# EAGLE design mouse17-18_v5.0.1.1 (EAGLE 8.4.0)
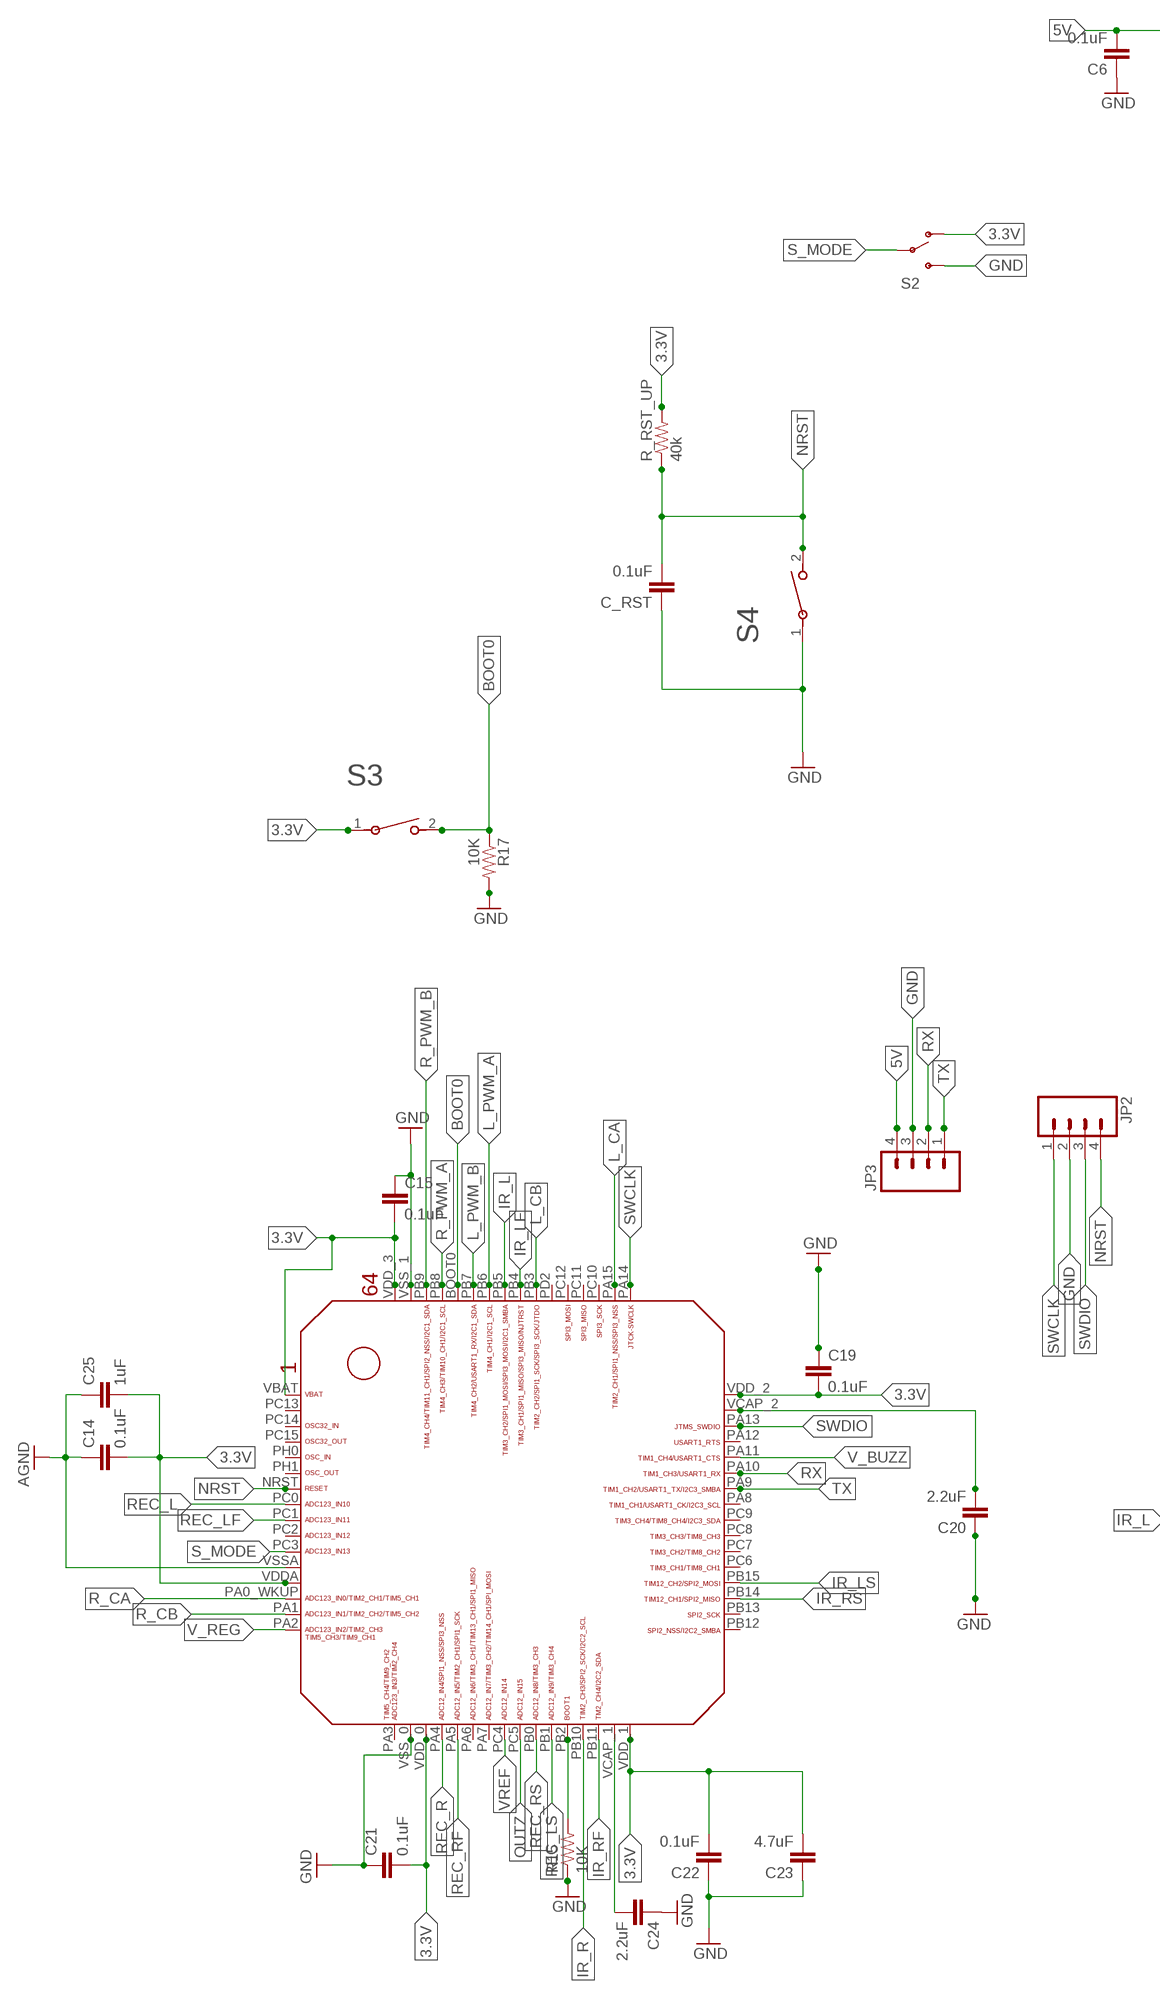
[diagram p0: schematic, sheet 1, part 1 of 2]
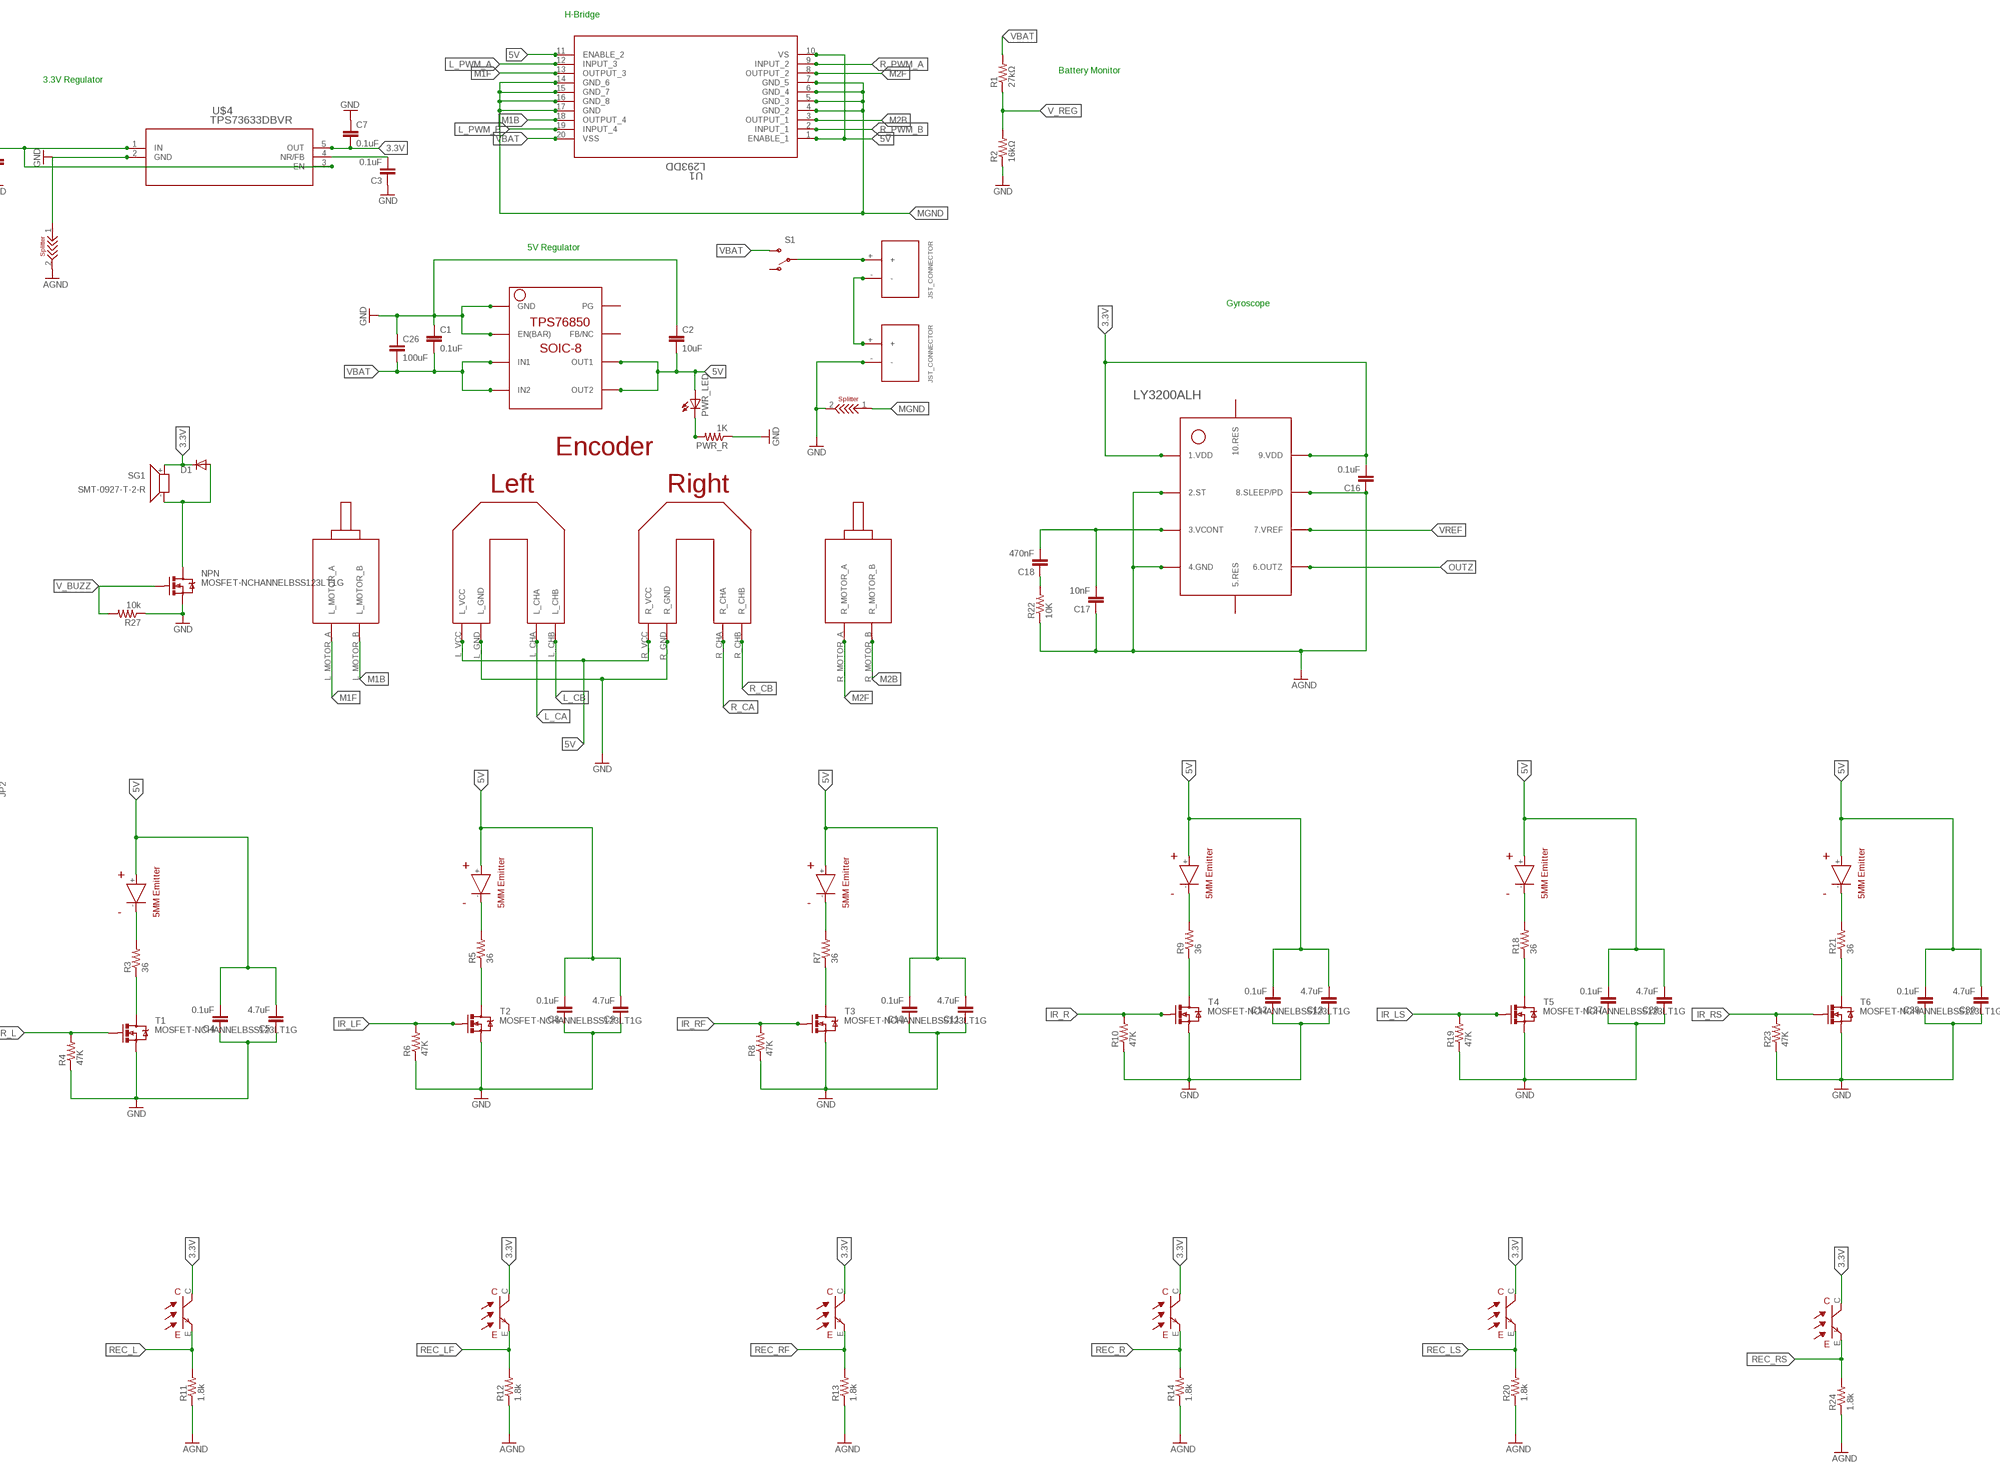
[diagram p1: schematic, sheet 1, part 2 of 2]

## Parts
C1  0.1uF  CAP0805  [0805]
C2  10uF  CAP0805  [0805]
C3  0.1uF  CC0603  [C0603]
C4  0.1uF  0.1UF-25V-5%(0603)  [0603-CAP]
C5  4.7uF  4.7UF-6.3V-10%(0603)0603  [0603-CAP]
C6  0.1uF  CC0603  [C0603]
C7  0.1uF  CC0603  [C0603]
C8  0.1uF  0.1UF-25V-5%(0603)  [0603-CAP]
C9  4.7uF  4.7UF-6.3V-10%(0603)0603  [0603-CAP]
C10  0.1uF  0.1UF-25V-5%(0603)  [0603-CAP]
C11  4.7uF  4.7UF-6.3V-10%(0603)0603  [0603-CAP]
C12  0.1uF  0.1UF-25V-5%(0603)  [0603-CAP]
C13  4.7uF  4.7UF-6.3V-10%(0603)0603  [0603-CAP]
C14  0.1uF  0.1UF-25V-5%(0603)  [0603-CAP]
C15  0.1uF  0.1UF-25V-5%(0603)  [0603-CAP]
C16  0.1uF  CAP0603-CAP  [0603-CAP]
C17  10nF  CAP0603-CAP  [0603-CAP]
C18  470nF  CAP0603-CAP  [0603-CAP]
C19  0.1uF  0.1UF-25V-5%(0603)  [0603-CAP]
C20  2.2uF  0.1UF-25V-5%(0603)  [0603-CAP]
C21  0.1uF  0.1UF-25V-5%(0603)  [0603-CAP]
C22  0.1uF  10UF-6.3V-20%(0603)  [0603-CAP]
C23  4.7uF  4.7UF-6.3V-10%(0603)0603  [0603-CAP]
C24  2.2uF  0.1UF-25V-5%(0603)  [0603-CAP]
C25  1uF  0.1UF-25V-5%(0603)  [0603-CAP]
C26  100uF  CC1210  [C1210]
C27  0.1uF  0.1UF-25V-5%(0603)  [0603-CAP]
C28  4.7uF  4.7UF-6.3V-10%(0603)0603  [0603-CAP]
C29  0.1uF  0.1UF-25V-5%(0603)  [0603-CAP]
C30  4.7uF  4.7UF-6.3V-10%(0603)0603  [0603-CAP]
C_RST  0.1uF  0.1UF-25V-5%(0603)  [0603-CAP]
D1  DIODESMA  [SMA-DIODE]
JP2  M04PTH  [1X04]
JP3  M04PTH  [1X04]
NPN  MOSFET-NCHANNELBSS123LT1G  [SOT23-3]
PWR_LED  LED_ESML0603  [LED_SML0603]
PWR_R  1K  RESISTOR0805-RES  [0805]
R1  27kΩ  RESISTOR0805-RES  [0805]
R2  16kΩ  RESISTOR0805-RES  [0805]
R3  36  RESISTOR0805-RES  [0805]
R4  47K  47KOHM1/10W1%(0603)  [0603-RES]
R5  36  RESISTOR0805-RES  [0805]
R6  47K  47KOHM1/10W1%(0603)  [0603-RES]
R7  36  RESISTOR0805-RES  [0805]
R8  47K  47KOHM1/10W1%(0603)  [0603-RES]
R9  36  RESISTOR0805-RES  [0805]
R10  47K  47KOHM1/10W1%(0603)  [0603-RES]
R11  1.8k  1.8KOHM1/10W1%(0603)  [0603-RES]
R12  1.8k  1.8KOHM1/10W1%(0603)  [0603-RES]
R13  1.8k  1.8KOHM1/10W1%(0603)  [0603-RES]
R14  1.8k  1.8KOHM1/10W1%(0603)  [0603-RES]
R15  10K  10KOHM-1/10W-1%(0603)0603  [0603-RES]
R17  10K  10KOHM-1/10W-1%(0603)0603  [0603-RES]
R18  36  RESISTOR0805-RES  [0805]
R19  47K  47KOHM1/10W1%(0603)  [0603-RES]
R20  1.8k  1.8KOHM1/10W1%(0603)  [0603-RES]
R21  36  RESISTOR0805-RES  [0805]
R22  10K  RESISTOR0603-RES  [0603-RES]
R23  47K  47KOHM1/10W1%(0603)  [0603-RES]
R24  1.8k  1.8KOHM1/10W1%(0603)  [0603-RES]
R27  10k  20OHM1/10W1%(0603)SMD  [0603-RES]
R_RST_UP  40k  10KOHM-1/10W-1%(0603)0603  [0603-RES]
S1  SWITCH-SPSTPTH  [SWITCH-SPDT]
S2  SWITCH-SPST-SMD-A  [SWITCH-SPST-SMD-A]
S3  1825965-1  [SWDIP2_256X198P100]
S4  1825965-1  [SWDIP2_256X198P100]
SG1  SMT-0927-T-2-R  [SMT-0927-T-2-R]
T1  MOSFET-NCHANNELBSS123LT1G  [SOT23-3]
T2  MOSFET-NCHANNELBSS123LT1G  [SOT23-3]
T3  MOSFET-NCHANNELBSS123LT1G  [SOT23-3]
T4  MOSFET-NCHANNELBSS123LT1G  [SOT23-3]
T5  MOSFET-NCHANNELBSS123LT1G  [SOT23-3]
T6  MOSFET-NCHANNELBSS123LT1G  [SOT23-3]
U1  L293DD  [SO-20]
U$1  TPS76850(SOIC-8)  [TPS76850(SOIC-8)]
U$2  JST_CONNECTOR_FEMALE  [JST_CONNECTOR_FEMALE]
U$3  JST_CONNECTOR_FEMALE  [JST_CONNECTOR_FEMALE]
U$4  TPS73633DBVR  [DBV5]
U$5  FUTURA_V1.0_MOTOR_MOUNT  [FUTURA_V1.0_MOTOT_MOUNT]
U$6  EMITTER  [EMITTER]
U$7  EMITTER  [EMITTER]
U$8  EMITTER  [EMITTER]
U$9  EMITTER  [EMITTER]
U$11  RECEIVER  [RECEIVER]
U$13  SPLITTER  [SPLITTER]
U$15  RECEIVER  [RECEIVER]
U$17  STM32F405/415_LQFP64  [STM32F405/415_LQFP64]
U$18  RECEIVER  [RECEIVER]
U$19  RECEIVER  [RECEIVER]
U$22  SPLITTER  [SPLITTER]
U$23  LY3200ALH  [LY3200ALH]
U$25  EMITTER  [EMITTER]
U$27  RECEIVER  [RECEIVER]
U$28  EMITTER  [EMITTER]
U$30  RECEIVER  [RECEIVER]

## Nets
3.3V: C7.2 C14.2 C15.2 C16.2 C19.2 C21.2 C22.2 C23.2 C25.2 D1.C R_RST_UP.2 S2.1(O) S3.1 SG1.+ U$4.5(OUT) U$11.C U$15.C U$17.VBAT U$17.VDD_0 U$17.VDD_1 U$17.VDD_2 U$17.VDD_3 U$17.VDDA U$18.C U$19.C U$23.1.VDD@1(1.VDD) U$23.9.VDD@2(9.VDD) U$27.C U$30.C
5V: C2.2 C4.2 C5.2 C6.2 C8.2 C9.2 C10.2 C11.2 C12.2 C13.2 C27.2 C28.2 C29.2 C30.2 JP3.4 PWR_LED.A U1.1(ENABLE_1) U1.10(VS) U1.11(ENABLE_2) U$1.OUT1 U$1.OUT2 U$4.1(IN) U$4.3(EN) U$5.L_VCC U$5.R_VCC U$6.+ U$7.+ U$8.+ U$9.+ U$25.+ U$28.+
AGND: C14.1 C16.1 C17.1 C25.1 R11.1 R12.1 R13.1 R14.1 R20.1 R22.1 R24.1 U$13.2 U$17.VSSA U$23.2.ST U$23.4.GND U$23.8.SLEEP/PD
BOOT0: R17.1 S3.2 U$17.BOOT0
GND: C1.1 C2.1 C3.1 C4.1 C5.1 C6.1 C7.1 C8.1 C9.1 C10.1 C11.1 C12.1 C13.1 C15.1 C19.1 C20.1 C21.1 C22.1 C23.1 C24.1 C26.1 C27.1 C28.1 C29.1 C30.1 C_RST.1 JP2.2 JP3.3 NPN.2(S) PWR_R.1 R2.1 R4.1 R6.1 R8.1 R10.1 R15.1 R17.2 R19.1 R23.1 R27.1 S2.3(S) S4.1 T1.2(S) T2.2(S) T3.2(S) T4.2(S) T5.2(S) T6.2(S) U$1.EN(BAR) U$1.GND U$3.- U$4.2(GND) U$5.L_GND U$5.R_GND U$13.1 U$17.VSS_0 U$17.VSS_1 U$22.2
IR_L: R4.2 T1.1(G) U$17.PB5
IR_LF: R6.2 T2.1(G) U$17.PB4
IR_LS: R19.2 T5.1(G) U$17.PB15
IR_R: R10.2 T4.1(G) U$17.PB10
IR_RF: R8.2 T3.1(G) U$17.PB11
IR_RS: R23.2 T6.1(G) U$17.PB14
L_CA: U$5.L_CHA U$17.PA15
L_CB: U$5.L_CHB U$17.PB3
L_PWM_A: U1.12(INPUT_3) U$17.PB6
L_PWM_B: U1.19(INPUT_4) U$17.PB7
LED_L: R3.2 U$6.-
LED_LF: R5.2 U$7.-
LED_LS: R18.2 U$25.-
LED_R: R9.2 U$9.-
LED_RF: R7.2 U$8.-
LED_RS: R21.2 U$28.-
M1B: U1.18(OUTPUT_4) U$5.L_MOTOR_B
M1F: U1.13(OUTPUT_3) U$5.L_MOTOR_A
M2B: U1.3(OUTPUT_1) U$5.R_MOTOR_B
M2F: U1.8(OUTPUT_2) U$5.R_MOTOR_A
MGND: U1.4(GND_2) U1.5(GND_3) U1.6(GND_4) U1.7(GND_5) U1.14(GND_6) U1.15(GND_7) U1.16(GND_8) U1.17(GND) U$22.1
N$1: S1.2(P) U$2.+
N$2: U$2.- U$3.+
N$4: R5.1 T2.3(D)
N$6: D1.A NPN.3(D) SG1.-
N$7: R3.1 T1.3(D)
N$8: R7.1 T3.3(D)
N$10: R9.1 T4.3(D)
N$11: C17.2 C18.2 U$23.3.VCONT
N$12: C3.2 U$4.4(NR/FB)
N$13: C20.2 U$17.VCAP_2
N$14: C24.2 U$17.VCAP_1
N$16: R15.2 U$17.PB2
N$18: C18.1 R22.2
N$20: PWR_LED.C PWR_R.2
N$21: R18.1 T5.3(D)
N$23: R21.1 T6.3(D)
NRST: C_RST.2 JP2.4 R_RST_UP.1 S4.2 U$17.NRST
OUTZ: U$17.PC5 U$23.6.OUTZ
R_CA: U$5.R_CHA U$17.PA0_WKUP(PA0_AKUP)
R_CB: U$5.R_CHB U$17.PA1
R_PWM_A: U1.9(INPUT_2) U$17.PB8
R_PWM_B: U1.2(INPUT_1) U$17.PB9
REC_L: R11.2 U$17.PC0 U$19.E
REC_LF: R12.2 U$17.PC1 U$18.E
REC_LS: R20.2 U$17.PB1 U$27.E
REC_R: R14.2 U$11.E U$17.PA4
REC_RF: R13.2 U$15.E U$17.PA5
REC_RS: R24.2 U$17.PB0 U$30.E
RX: JP3.2 U$17.PA10
S_MODE: S2.2(P) U$17.PC3
SWCLK: JP2.1 U$17.PA14
SWDIO: JP2.3 U$17.PA13
TX: JP3.1 U$17.PA9
V_BUZZ: NPN.1(G) R27.2 U$17.PA11
V_REG: R1.1 R2.2 U$17.PA2
VBAT: C1.2 C26.2 R1.2 S1.3(S) U1.20(VSS) U$1.IN1 U$1.IN2
VREF: U$17.PC4 U$23.7.VREF
Unconnected: S1.1(O) U$1.FB/NC U$1.PG U$17.PA3 U$17.PA6 U$17.PA7 U$17.PA8 U$17.PA12 U$17.PB12 U$17.PB13 U$17.PC2 U$17.PC6 U$17.PC7 U$17.PC8 U$17.PC9 U$17.PC10 U$17.PC11 U$17.PC12 U$17.PC13 U$17.PC14 U$17.PC15 U$17.PD2 U$17.PH0 U$17.PH1 U$23.5.RES@1(5.RES) U$23.10.RES@2(10.RES)

## Notes on the sheet
- H-Bridge
- Battery Monitor
- 3.3V Regulator
- 5V Regulator
- Gyroscope

## Library data of the parts
C1 C2 C16-C18 = SparkFun:CAP: Capacitor Standard 0603 ceramic capacitor, and 0.1" leaded capacitor.
C3 C6 C7 C26 = eagle-ltspice:C: CAPACITOR, European symbol; SPICEMODEL: NONE; SPICEPREFIX: C
C4 C8 C10 C12 C14 C15 C19 C21 C27 C29 C_RST = SparkFun-Capacitors:0.1UF-25V-5%(0603): CAP-08604; PROD_ID: CAP-08604
C5 C9 C11 C13 C23 C28 C30 = SparkFun-Capacitors:4.7UF-6.3V-10%(0603): CAP-08280; PROD_ID: CAP-08280
C20 C24 C25 = SparkFun-Capacitors:0.1UF-25V-5%(0603): CAP-08604; PROD_ID: CAP-08604; VALUE: 0.1uF
C22 = SparkFun-Capacitors:10UF-6.3V-20%(0603): CAP-11015; PROD_ID: CAP-11015; VALUE: 10uF
D1 = SparkFun:DIODE: Diode These are standard reverse protection diodes and small signal diodes. SMA package can handle up to about 1A. SOD-323 can handle about 200mA. What the SOD-323 package when ordering, there are some mfgs out there that are 5-pin packages.
JP2 JP3 = SparkFun:M04: Header 4 Standard 4-pin 0.1" header. Use with straight break away headers (SKU : PRT-00116), right angle break away headers (PRT-00553), swiss pins (PRT-00743), machine pins (PRT-00117), and female headers (PRT-00115). Molex polarized connector foot print use with SKU : PRT-08231 with associated crimp pins and housings. 1MM SMD Version SKU: PRT-10208
NPN T1-T6 = SparkFun-DiscreteSemi:MOSFET-NCHANNEL: Common NMOSFET Parts MFG P/N Store ID Prod ID FDD8780 TRANS-09984 SI7820DN TRANS-11055 FDS6630A IC-08089 2N7002PW TRANS-11151 FQP30N06L COM-10213 TRANS-10060 BSS123LT1G TRANS-08345 BSS138 TRANS-00830 BS170 2N7000; PROD_ID: TRANS-08345
PWR_LED = eagle-ltspice:LED_E: LED Source: http://www.osram.convergy.de Source: www.luxeon.com Source: www.kingbright.com; SPICEMODEL: NONE; SPICEPREFIX: D; SPICETYPE: diode
PWR_R R1 R2 = SparkFun:RESISTOR: Resistor Basic schematic elements and footprints for 0603, 1206, and PTH resistors.
R3 R5 R7 R9 R18 R21 R22 = SparkFun-Passives:RESISTOR: Resistor Basic schematic elements and footprints for 0603, 1206, and PTH resistors.
R4 R6 R8 R10 R19 R23 = SparkFun-Resistors:47KOHM1/10W1%(0603): RES-07871; PROD_ID: RES-07871
R11-R14 R20 R24 = SparkFun-Resistors:1.8KOHM1/10W1%(0603): RES-09119; PROD_ID: RES-09119
R15 R17 = SparkFun-Resistors:10KOHM-1/10W-1%(0603): RES-00824; PROD_ID: RES-00824
R27 = SparkFun-Resistors:20OHM1/10W1%(0603): RES-07862; PROD_ID: RES-07862; VALUE: 20
R_RST_UP = SparkFun-Resistors:10KOHM-1/10W-1%(0603): RES-00824; PROD_ID: RES-00824; VALUE: 10K
S1 S2 = SparkFun:SWITCH-SPST: SPST Switch Simple slide switch. Spark Fun Electronics SKU : COM-00102
S3 S4 = 1825965-1:1825965-1; MANUFACTURER_PART_NUMBER: 18259651; VENDOR: Tyco Electronics
SG1 = SMT-0927-T-2-R:SMT-0927-T-2-R: SMD TRANSDUCER 3VP-P 80MA
U1 = L293DD:L293DD; MANUFACTURER_PART_NUMBER: L293DD; VENDOR: ST Microelectronics
U$1 = TPS76850(SOIC-8):TPS76850(SOIC-8)
U$2 U$3 = JST_CONNECTOR_FEMALE. through hole:JST_CONNECTOR_FEMALE
U$4 = TPS73633DBVR:TPS73633DBVR; MANUFACTURER_PART_NUMBER: TPS73633DBVR; VENDOR: Texas Instruments
U$5 = Futura 1.0 motor mount template:FUTURA_V1.0_MOTOR_MOUNT
U$6-U$9 U$25 U$28 = sfh4550 & teft4300:EMITTER
U$11 U$15 U$18 U$19 U$27 U$30 = sfh4550 _ teft4300:RECEIVER
U$13 U$22 = splitter:SPLITTER
U$17 = STM32F10x F4xx:STM32F405/415_LQFP64
U$23 = LY3200ALH:LY3200ALH

## Net classes
0 default: width 0.127 mm
1 VBAT: width 1.905 mm
2 MOTOR: width 1.143 mm
3 IRLED: width 1.016 mm
4 IRREC: width 0.889 mm

## Board
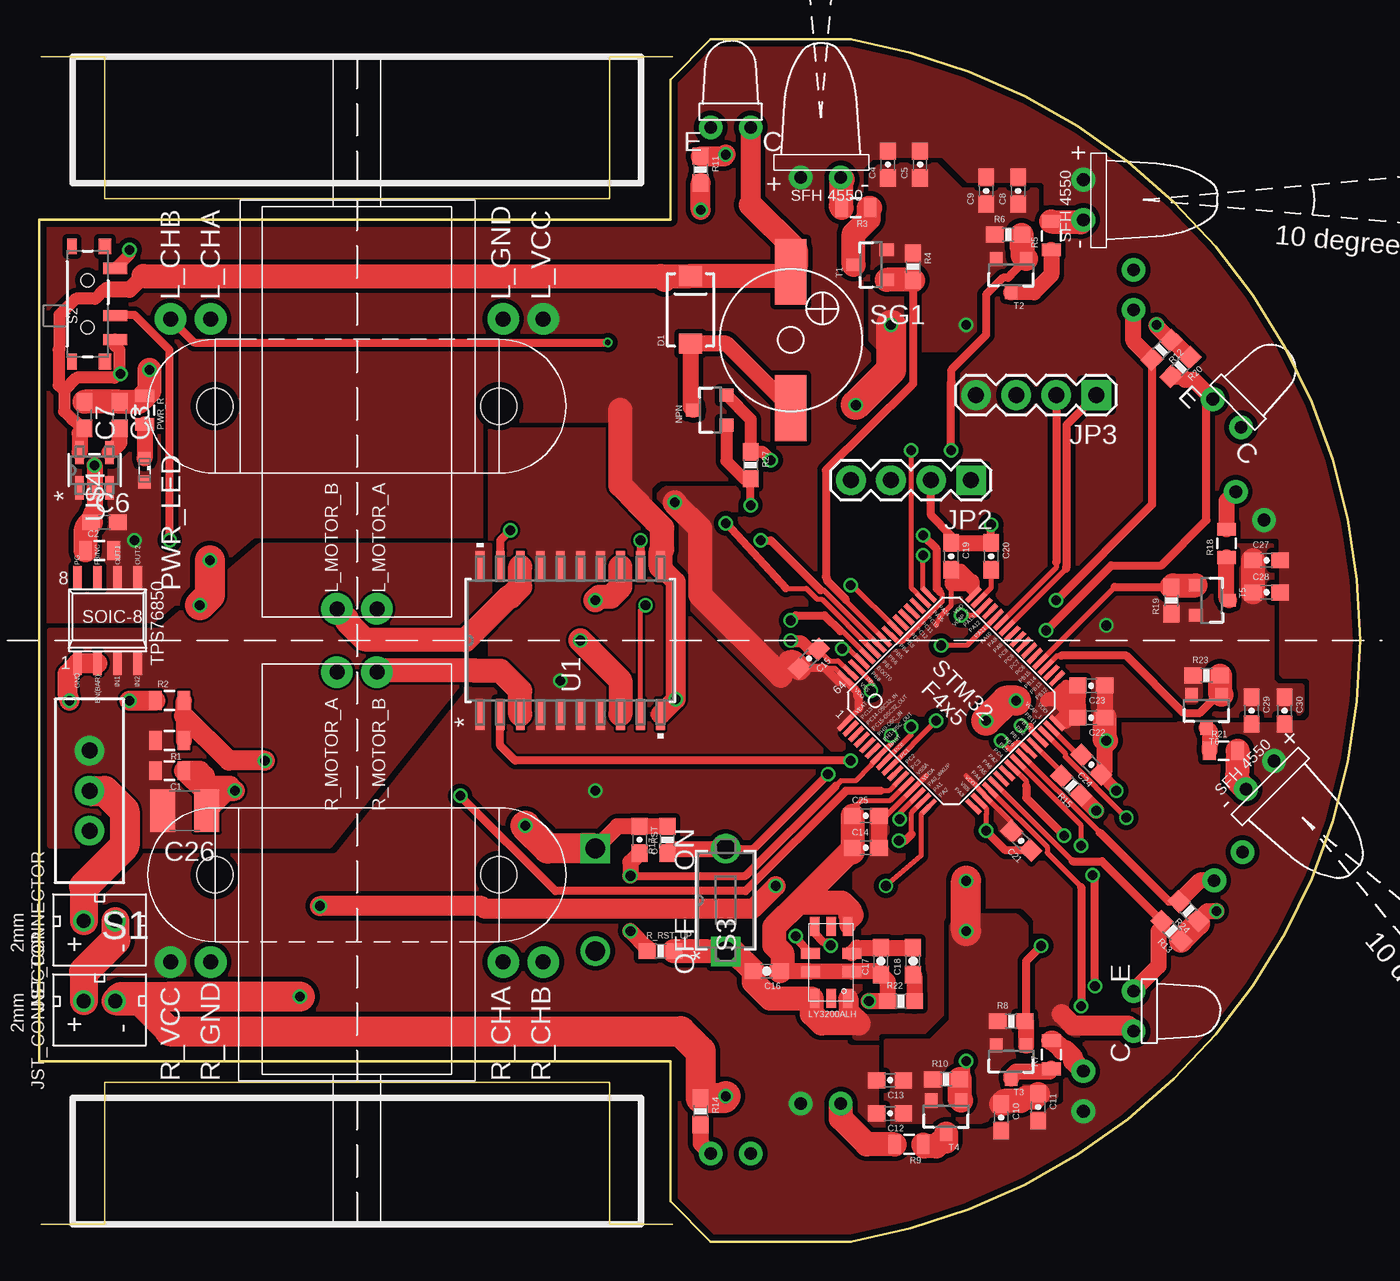
[diagram p2: board, top side]
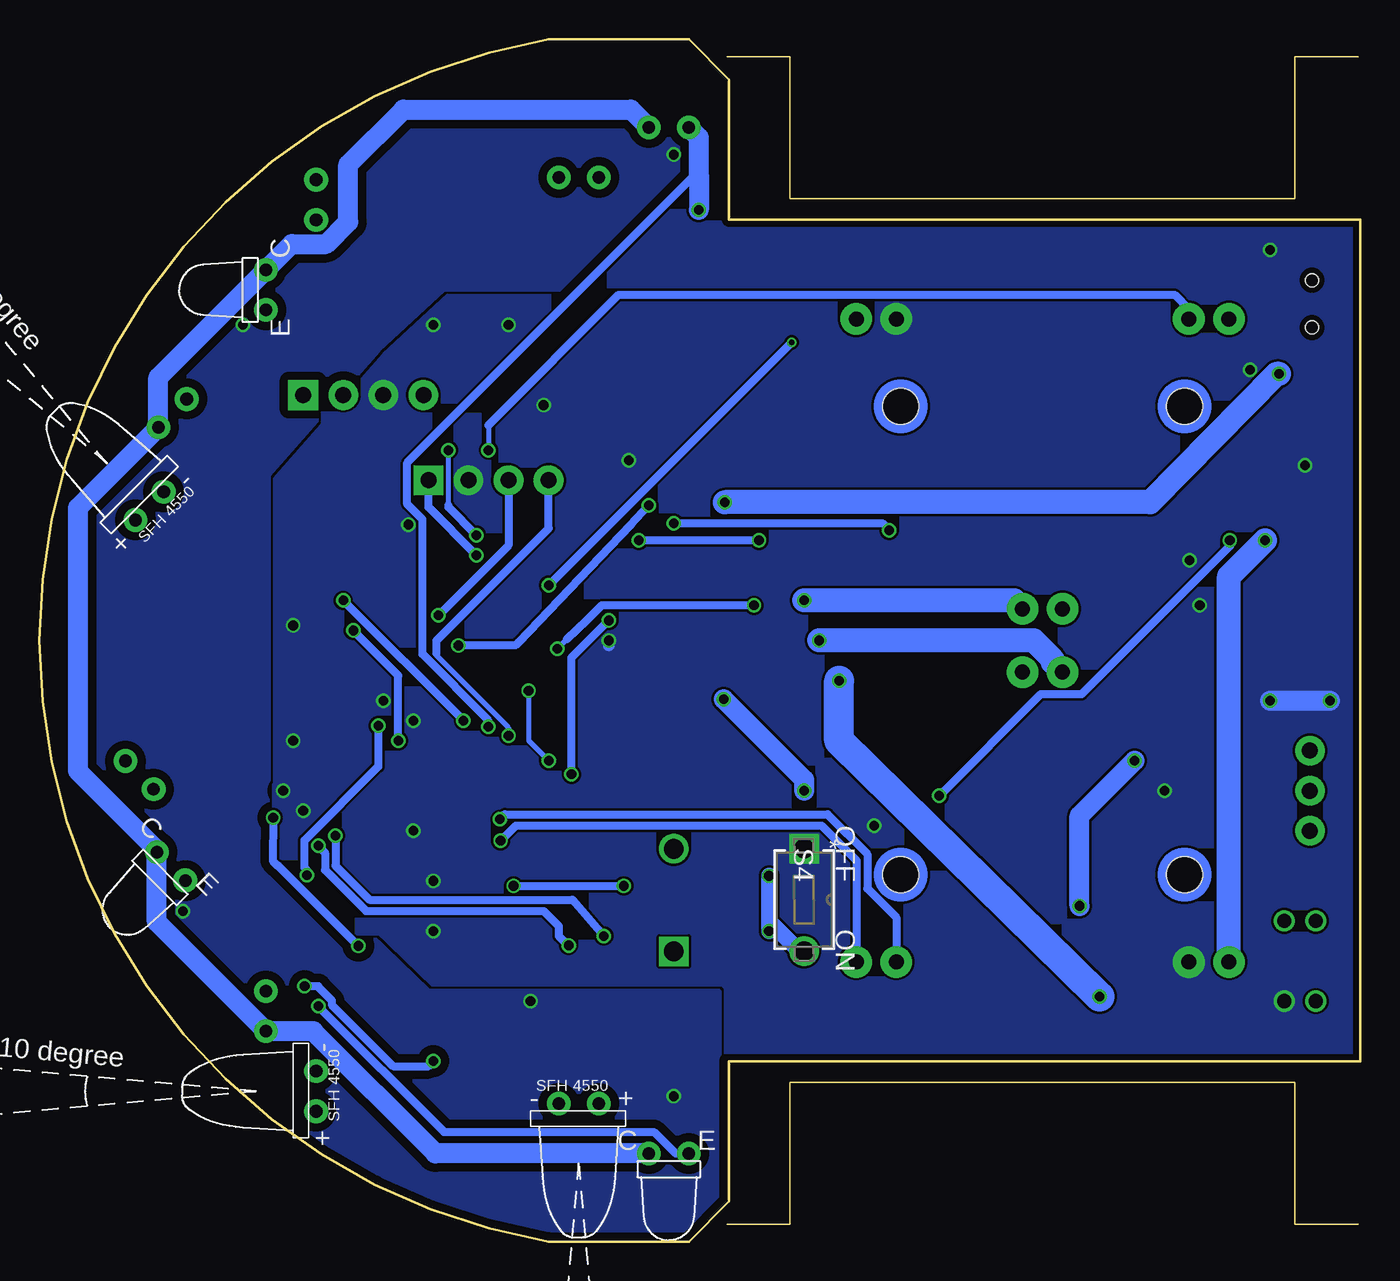
[diagram p3: board, bottom side, seen from below]

Size 83.71 x 76.2 mm. Coordinates in mm from the lower left corner, seen from the top.
Outline: 51.44,0 42.55,0 40.01,2.54 40.01,11.43 0,11.43 0,64.77 40.01,64.77 40.01,73.66 42.55,76.2 51.44,76.2 arc-161 51.44,0
Copper layers (1*16): Top 0.035559375mm / dielectric 1.6mm / Bottom 0.035559375mm
Design rules "oshpark-2layer-1": minimum track width 6mil, minimum drill 10mil, track to track 6mil, track to pad 6mil, pad to pad 6mil, via to via 6mil, smd to smd 6mil, copper to edge 15mil, drill to drill 6mil, minimum pad ring 5mil, minimum via ring 5mil, stop-mask expansion 2.5mil, vias tented up to drill 0mil, thermal gap 10mil

### Footprints (pad centres in the part's own frame; a part is rotated, then mirrored left to right if it is on the bottom)
0805 = smd 0.8 x 1.2: 1 -0.9,0; 2 0.9,0
C0603 = smd 1.1 x 1: 1 -0.85,0; 2 0.85,0
0603-CAP = smd 1.1 x 1: 1 -0.85,0; 2 0.85,0
C1210 = smd 1.6 x 2.7: 1 -1.4,0; 2 1.4,0
SMA-DIODE = smd 1.27 x 1.47: A -2.15,0; C 2.15,0
1X04 = drill 1.016 pad 1.88 square: 1 0,0 | drill 1.016 pad 1.88: 2 2.54,0; 3 5.08,0; 4 7.62,0
SOT23-3 = smd 0.8 x 0.9: 1 -0.95,-1; 2 0.95,-1; 3 0,1.1
LED_SML0603 = smd 0.8 x 0.8: A 0.75,0; C -0.75,0
0603-RES = smd 1.1 x 1: 1 -0.85,0; 2 0.85,0
SWITCH-SPDT = drill 1.016 pad 1.88: 1 0,2.54; 2 0,0; 3 0,-2.54
SWITCH-SPST-SMD-A = smd 0.7 x 1.5: 1 -2.25,-1.75; 2 -0.75,-1.75; 3 2.25,-1.75 | smd 1 x 0.6: GND1 -3.65,1; GND3 3.65,1 | smd 1 x 0.8: GND2 -3.65,-1.1; GND4 3.65,-1.1 | hole 0.813: -1.5,0; 1.5,0
SWDIP2_256X198P100 = drill 1.245 pad 1.753 square: 1 -6.502,0 | drill 1.245 pad 1.753: 2 0,0
SMT-0927-T-2-R = smd 2 x 4.16: + 0,4.32; - 0,-4.32
SO-20 = smd 1.981 x 0.559: 1 -4.686,5.715; 2 -4.686,4.445; 3 -4.686,3.175; 4 -4.686,1.905; 5 -4.686,0.635; 6 -4.686,-0.635; 7 -4.686,-1.905; 8 -4.686,-3.175; 9 -4.686,-4.445; 10 -4.686,-5.715; 11 4.686,-5.715; 12 4.686,-4.445; 13 4.686,-3.175; 14 4.686,-1.905; 15 4.686,-0.635; 16 4.686,0.635; 17 4.686,1.905; 18 4.686,3.175; 19 4.686,4.445; 20 4.686,5.715
TPS76850(SOIC-8) = smd 0.55 x 1.5: EN(BAR) -0.635,-2.7; FB/NC -0.635,2.7; GND -1.905,-2.7; IN1 0.635,-2.7; IN2 1.905,-2.7; OUT1 0.635,2.7; OUT2 1.905,2.7; PG -1.905,2.7
JST_CONNECTOR_FEMALE = drill 0.889: + 0,1; - 0,-1
DBV5 = smd 1.473 x 0.559: 1 -1.118,0.95; 2 -1.118,0; 3 -1.118,-0.95; 4 1.118,-0.95; 5 1.118,0.95
FUTURA_V1.0_MOTOT_MOUNT = drill 0.95 pad 2: L_CHA -20.375,26.73; L_CHB -20.375,24.19; L_GND -20.375,45.27; L_MOTOR_A -2,37.27; L_MOTOR_B -2,34.73; L_VCC -20.375,47.81; R_CHA 20.375,45.27; R_CHB 20.375,47.81; R_GND 20.375,26.73; R_MOTOR_A 2,34.73; R_MOTOR_B 2,37.27; R_VCC 20.375,24.19 | hole 2.286: 14.85,45; 14.85,27; -14.85,27; -14.85,45
EMITTER = drill 0.8 pad 1.5: + -1.27,-0.5; - 1.27,-0.5
RECEIVER = drill 0.8 pad 1.5: C 1.27,-0.5; E -1.27,-0.5
SPLITTER = smd 0.102 x 0.102: 1 0,0; 2 0,0
STM32F405/415_LQFP64 = smd 1.2 x 0.3: BOOT0 -5.75,-1.75; PA3 5.75,-3.75; PA4 5.75,-2.25; PA5 5.75,-1.75; PA6 5.75,-1.25; PA7 5.75,-0.75; PA14 -5.75,3.75; PA15 -5.75,3.25; PB0 5.75,0.75; PB1 5.75,1.25; PB2 5.75,1.75; PB3 -5.75,0.75; PB4 -5.75,0.25; PB5 -5.75,-0.25; PB6 -5.75,-0.75; PB7 -5.75,-1.25; PB8 -5.75,-2.25; PB9 -5.75,-2.75; PB10 5.75,2.25; PB11 5.75,2.75; PC4 5.75,-0.25; PC5 5.75,0.25; PC10 -5.75,2.75; PC11 -5.75,2.25; PC12 -5.75,1.75; PD2 -5.75,1.25; VCAP_1 5.75,3.25; VDD_0 5.75,-2.75; VDD_1 5.75,3.75; VDD_3 -5.75,-3.75; VSS_0 5.75,-3.25; VSS_1 -5.75,-3.25 | smd 0.3 x 1.2: NRST -0.75,-5.75; PA0_WKUP 2.75,-5.75; PA1 3.25,-5.75; PA2 3.75,-5.75; PA8 -0.25,5.75; PA9 -0.75,5.75; PA10 -1.25,5.75; PA11 -1.75,5.75; PA12 -2.25,5.75; PA13 -2.75,5.75; PB12 3.75,5.75; PB13 3.25,5.75; PB14 2.75,5.75; PB15 2.25,5.75; PC0 -0.25,-5.75; PC1 0.25,-5.75; PC2 0.75,-5.75; PC3 1.25,-5.75; PC6 1.75,5.75; PC7 1.25,5.75; PC8 0.75,5.75; PC9 0.25,5.75; PC13 -3.25,-5.75; PC14 -2.75,-5.75; PC15 -2.25,-5.75; PH0 -1.75,-5.75; PH1 -1.25,-5.75; VBAT -3.75,-5.75; VCAP_2 -3.25,5.75; VDD_2 -3.75,5.75; VDDA 2.25,-5.75; VSSA 1.75,-5.75
LY3200ALH = smd 0.6 x 1.2: 1.VDD@1 -1.065,2.37; 4.GND -1.065,-2.2; 5.RES@1 -0.015,-2.2; 6.OUTZ 1.035,-2.2; 9.VDD@2 1.035,2.37; 10.RES@2 -0.015,2.37 | smd 1.2 x 0.7: 2.ST -1.33,0.67; 3.VCONT -1.33,-0.5; 7.VREF 1.3,-0.5; 8.SLEEP/PD 1.3,0.67

### Placement (x,y rotation side)
C1  8.25,29.84 180 top
C2  3.81,43.82 0 top
C3  5.08,52.39 270 top
C4  53.78,68.26 90 top
C5  55.82,68.26 90 top
C6  4.13,45.59 0 top
C7  2.86,52.39 270 top
C8  62.04,66.61 90 top
C9  60.01,66.61 90 top
C10  60.96,7.87 270 top
C11  63.31,8.51 270 top
C12  53.91,8.13 180 top
C13  53.91,10.22 180 top
C14  52.39,24.96 0 top
C15  48.77,36.96 225 top
C16  46.1,17.14 180 top
C17  53.34,17.78 90 top
C18  55.37,17.78 90 top
C19  57.79,43.43 270 top
C20  60.33,43.43 270 top
C21  62.23,25.4 135 top
C22  66.67,33.21 180 top
C23  66.67,35.24 180 top
C24  66.67,30.23 135 top
C25  52.39,26.99 0 top
C26  9.21,27.3 180 top
C27  77.79,43.18 0 top
C28  77.79,41.15 0 top
C29  76.84,33.66 270 top
C30  78.93,33.66 270 top
C_RST  38.04,25.46 270 top
D1  41.28,59.05 90 top
JP2  59.05,48.26 180 top
JP3  66.99,53.66 180 top
NPN  42.55,52.71 90 top
PWR_LED  6.67,48.9 270 top
PWR_R  6.67,52.71 270 top
R1  8.25,31.75 180 top
R2  8.25,34.29 0 top
R3  51.75,65.53 180 top
R4  55.37,61.79 270 top
R5  64.14,63.75 90 top
R6  61.4,63.82 0 top
R7  64.14,11.85 90 top
R8  61.59,13.97 0 top
R9  55.12,6.16 180 top
R10  57.47,10.29 0 top
R11  41.91,67.94 270 top
R12  71.12,56.52 225 top
R13  71.76,19.68 135 top
R14  41.91,8.26 270 top
R15  65.41,28.89 135 top
R17  39.81,25.46 90 top
R18  75.25,44.26 90 top
R19  71.76,40.64 90 top
R20  72.33,55.44 225 top
R21  75.06,31.11 0 top
R22  54.61,15.24 0 top
R23  73.98,35.88 0 top
R24  72.83,20.95 135 top
R27  45.09,49.21 270 top
R_RST_UP  39.37,18.41 0 top
S1  3.17,28.57 180 top
S2  3.05,59.44 90 top
S3  43.5,24.89 90 top
S4  35.24,18.41 270 bottom
SG1  47.62,57.15 0 top
T1  52.71,61.91 90 top
T2  61.59,61.28 180 top
T3  61.59,11.43 180 top
T4  57.47,7.94 180 top
T5  74.3,40.64 270 top
T6  73.98,33.66 180 top
U1  33.66,38.1 90 top
U$1  4.32,39.37 0 top
U$2  3.81,20.32 90 top
U$3  3.81,15.24 90 top
U$4  3.49,48.9 90 top
U$5  -15.88,38.1 270 top
U$6  49.53,67.94 0 top
U$7  66.67,66.04 270 top
U$8  66.67,9.53 90 bottom
U$9  49.53,8.26 180 bottom
U$11  43.82,5.08 180 bottom
U$13  8.25,13.33 0 top
U$15  69.85,14.61 270 top
U$17  57.79,34.29 315 top
U$18  69.85,60.33 90 bottom
U$19  43.82,71.12 0 top
U$22  8.25,15.53 0 top
U$23  50.17,17.78 180 top
U$25  77.09,46.99 45 bottom
U$27  75.63,52.86 315 top
U$28  77.72,29.21 225 top
U$30  75.72,23.43 135 bottom

### Tracks (layer width: path | path; a pad name or v marks a point on that pad's centre or on a via)
3.3V  (via drill 0.61)
  Top 0.305: C22.2 65.49,32.88 65.09,32.88 U$17.VDD_1 | U$17.VDD_2 59.2,41.28 | 57.79,41.91 C19.2 | C23.2 65.09,35.24 64.77,35.24 63.98,34.45 63.82,34.29 | 51.75,34.93 51.75,35.02 U$17.VDD_3 50.42,36.36 48.26,36.36 C15.2 | C25.2 53.66,26.99 U$17.VDDA 56.2,29.53 | C21.2 61.63,26.56 U$17.VDD_0 59.91,28.34 59.43,28.82 59.43,28.84 58.74,29.53 | U$17.VBAT 51.96,33.77 52.07,33.88 52.07,33.97 | 51.27,14.48 51.93,13.82 | v5.14,55.01 5.08,55.07 | 57.89,41.59 57.79,41.48 57.79,40.32 57.15,39.69 56.83,39.05
  Top 0.508: U$23.9.VDD@2 49.1,15.41 49.09,15.41 | 51.96,33.77 51.96,34.45 51.84,34.57 51.84,34.85 51.19,35.5 50.64,35.5 49.78,36.36 48.26,36.36
  Top 0.762: S2.1 4.8,56.79 5.08,56.51 5.08,55.07 4.77,54.75 2.38,54.75 1.56,53.93 | C7.2 2.07,52.12 1.56,52.64 1.56,53.93 | 4.27,60.33 4.09,60.33 3.53,59.77 2.3,59.77 1.27,58.74 1.27,56.56 1.21,56.51 1.21,54.27 1.56,53.93 | 58.78,41.59 57.89,41.59 | 57.79,41.59 57.79,41.91 | 58.78,41.59 C19.2 58.42,42.58 59.09,41.91 59.2,41.91 59.2,41.28 58.88,41.59 58.78,41.59 | 65.25,35.08 65.09,35.24 | 65.25,35.08 65.72,34.61 | 65.72,34.61 65.83,34.61 65.51,34.29 64.45,34.29 | 64.45,34.29 63.82,34.29 | 63.98,34.45 64.61,34.45 65.25,35.08 | 65.72,34.61 65.72,34.08 65.83,33.97 | C22.2 65.53,33.21 65.41,33.34 | 65.41,33.34 64.45,34.29 | 65.41,33.34 65.41,33.19 65.09,32.88 | 65.41,33.34 64.96,33.34 64.63,33.01
  Top 1.016: 47.94,61.79 SG1.+ 47.36,61.21 | C23.2 65.83,34.61 65.83,33.97 C22.2 | 6.59,61.21 5.72,60.33 4.27,60.33 | C14.2 C25.2 | U$23.1.VDD@1 51.27,15.41 | C7.2 2.54,51.22 U$4.5
  Top 1.27: U$19.C 45.09,65.72 | 48.97,15.41 49.09,15.41 | 51.27,15.41 51.27,14.48 | 64.8,14.41 65.52,13.68 69.01,13.68 U$15.C
  Top 1.524: 45.09,65.72 47.94,62.87 47.94,61.79 | 47.36,61.21 D1.C 39.37,61.21 | 6.59,61.21 39.37,61.21 | 39.63,60.95 39.37,61.21 | C15.2 47.8,36.73 47.57,36.73 | 51.36,14.39 51.93,13.82 49.58,13.82 48.97,14.43 48.97,15.41 46.32,15.41 45.28,16.45 45.28,17.12 C16.2 44.01,18.39 S3.1 42.25,18.41 R_RST_UP.2 | v40.26,46.86 40.26,46.83 41.87,45.22 41.87,41 46.99,35.88
  Bottom 0.762: U$30.C 76.26,24.83
  Bottom 1.27: 76.26,24.83 81.28,29.84 81.28,46.5 U$27.C 76.17,54.77 U$18.C 67.71,63.23 65.54,63.23 64.14,64.64 64.14,68.26 60.64,71.75 46.22,71.75 U$19.C | U$11.C 58.6,5.58 66.36,13.33 U$15.C 76.26,20.25 U$30.C
  Bottom 1.524: v40.26,46.86 13.3,46.86 5.28,55.01 v5.14,55.01
  pour Top (isolate 0.305, rank 2, no thermals): 58.42,40.64 57.15,40.64 50.17,47.62 39.69,47.62 38.73,46.67 38.73,42.86 51.75,29.84 51.75,13.02 65.72,13.02 65.72,33.34
5V  (via drill 0.61)
  Top 1.27: U1.11 40.32,41.83 v40.32,34.37 U1.10
  Top 1.524: U1.11 39.37,43.78 39.47,43.88 39.47,45.25 37.95,46.77 37.95,46.82 36.83,47.94 36.83,52.71
  Bottom 1.27: v40.32,34.37 35.24,29.29 v35.24,28.57
  Bottom 1.524: U$5.R_VCC 8.32,42.17 v6.03,44.45
  pour Top (isolate 0.305, rank 5, no thermals): -0.63,9.53 39.37,9.53 39.37,1.91 41.91,-0.64 46.36,-0.64 arc180 46.36,76.83 41.91,76.83 39.37,74.3 39.37,65.41 -0.63,65.41
AGND  (via drill 0.61)
  Top 0.305: 51.76,26.99 C25.1 51.54,27.41 52.07,27.94 53.91,27.94 U$17.VSSA | U$23.8.SLEEP/PD
  Top 1.016: 73.44,20.16 R24.1 74.04,20.95 v74.61,20.95 | R20.1 71.85,57.12 R12.1 70.8,58.04 v70.8,58.1 | v52.58,15.24 R22.1 53.76,16.51 C17.1 53.16,17.11 U$23.2.ST U$23.8.SLEEP/PD | U$23.4.GND 51.23,20.43 51.44,20.64 | U$23.8.SLEEP/PD 46.99,17.11 C16.1
  Top 1.27: R11.1 43.4,68.8 v43.5,68.9
  Top 1.524: 73.44,20.16 R13.1 | C25.1 C14.1 | 51.5,24.65 51.54,24.69 C14.1 | 51.5,20.7 51.44,20.64 51.39,20.68 51.39,20.96 50.86,21.49 48.13,21.49 | 48.13,21.49 46.57,19.94 46.57,18.8 47.09,18.28 47.09,17.29 C16.1 | C14.1 51.54,24.9 48.13,21.49
  Top 1.905: U$13.2 40.64,13.33 41.91,12.06 R14.1 43.4,9.11 v43.5,9.21
  pour Bottom (isolate 0.533, rank 2, no thermals): 40.64,15.88 40.64,-1.27 86.36,-1.59 86.36,78.42 38.1,78.42 38.1,60.33 58.1,60.33 62.23,56.52 69.22,48.58 69.22,25.72 59.05,15.88
BOOT0  (via drill 0.61)
  Top 0.305: 50.76,38.7 50.9,38.7 52.32,37.28 U$17.BOOT0 | U$17.BOOT0
  Top 0.508: S3.2 45.26,24.89 v49.98,29.62 | v47.62,39.37 47.94,39.69 49.77,39.69 50.76,38.7
  Top 1.016: R17.1 40.09,24.89 S3.2
  Bottom 0.508: v49.98,29.62 49.98,37.01 v47.62,39.37
GND  (via drill 0.61)
  Top 0.305: v68.26,28.57 68.26,28.64 | 58.16,43.91 C19.1 | U$17.VSS_1 51.36,36.06 50.61,36.81 50.11,36.81 C15.1 | v60.01,26.04 60.01,27.1 60.03,27.13 60.03,27.44 U$17.VSS_0
  Top 0.508: C20.1 v60.33,45.45 | 62.53,9.12 62.4,9.12 62.18,8.91 | C21.1 61.24,24.8 v60.01,26.04 | C19.1 57.79,44.77 56.52,46.04 JP2.2 | v66.99,27.3
  Top 0.762: C3.1 5.4,53.29 | S2.3 5.72,62.6 v5.72,62.87 | NPN.2 45.09,52.12 R27.1 45.82,50.06 v46.36,49.53 | 68.26,28.64 C24.1 | C15.1 48.8,37.56 48.33,38.02 47.7,38.02 v47.62,38.1
  Top 0.889: C24.1 67.53,29.87
  Top 1.016: C23.1 C22.1 | R17.2 C_RST.1 36.64,26.31 S4.1 | C19.1 C20.1 | 67.53,29.87 67.53,31.85 | R15.1 v66.99,27.3 | v3.49,49.21 U$4.2 3.49,46.36
  Top 1.143: 3.49,46.36 arc45 3.28,45.84 C6.1
  Top 1.27: v5.72,34.29 R2.1 | v1.91,34.29 1.79,34.72 1.79,35.99 2.1,36.3 U$1.GND U$1.EN(BAR) | 10.48,28.89 10.48,29.53 10.16,29.84 C1.1 10.48,28.52 | 10.48,28.52 10.48,28.89 | 10.48,28.52 10.48,27.43 C26.1 11.88,28.57 v12.38,28.57 12.07,28.89 10.48,28.89
  Top 1.524: C28.1 C27.1 | 62.53,9.12 63.07,9.12 C11.1 | C10.1 61.14,8.91 62.18,8.91 62.24,8.97 62.27,8.97 | C22.1 67.53,31.85 v67.63,31.75 | C7.1 C3.1 6.3,53.24 PWR_R.1 6.99,53.92 v6.99,55.25 | C6.1 3.17,45.49 arc45 2.91,44.86 C2.1
  Top 1.778: U$13.1 6.35,15.24 U$3.- 5.13,15.56 U$22.2
  Top 1.905: S4.1 32.23,24.92 v30.8,26.35 | v61.91,34.29 61.28,34.29 v60.01,33.02 | v10.8,43.18 10.8,40.96 v10.16,40.32 | v53.98,58.1 53.98,55.25 v51.75,53.02 | v58.74,19.68 v58.74,22.86
  Bottom 0.762: v47.62,38.1 47.62,37.78
  Bottom 1.27: v5.72,34.29 v1.91,34.29
  other vias: 67.63,39.05 58.74,58.1
  pour Bottom (rank 5, no thermals): -1.9,10.48 81.6,10.48 81.6,65.41 80.01,65.41 -1.9,65.41
  pour Top (isolate 0.305, rank 4, no thermals): 64.45,37.78 68.26,41.59 75.56,41.59 75.56,44.13 78.11,44.13 78.11,35.56 78.42,35.24 80.01,35.24 80.01,33.66 79.69,33.34 64.77,33.34 64.45,33.66
  pour Top (isolate 0.305, no thermals): 59.69,7.62 64.45,9.21 64.45,12.7 62.55,14.61 62.55,20 61.91,20.64 58.42,20.64 57.79,20 57.79,13.97 56.52,12.7 53.66,12.7 53.66,7.62
  pour Top (isolate 0.305, rank 2, no thermals): 53.34,68.26 56.83,68.26 58.42,66.67 63.18,66.67 63.18,60.64 59.05,56.52 53.34,56.52 52.71,57.15 52.71,67.63
IR_L
  Top 0.305: U$17.PB5 51.12,40.6 51.12,40.69
  Top 0.508: 51.12,40.69 49.94,41.87 49.85,42.14 49.85,48.9 55.27,54.27 55.37,54.38 R4.2
  Top 1.524: R4.2 55.35,60.96 T1.1
IR_LF  (via drill 0.61)
  Top 0.305: 56.97,41.27 57.06,41.19 57.21,41.05 57.21,40.56 54.69,38.05 54.38,38.05 U$17.PB4
  Top 0.508: T2.1 61.59,61.33 61.59,61.28 61.41,61.09 61.09,61.09 60.01,60.02 60.01,57.47 57.81,55.27 57.81,54.49 57.79,54.47 v57.79,50.17 | 57.06,41.19 57.06,41.2 56.88,41.39 56.88,43.9 v56.01,44.77
  Top 1.524: R6.2 62.26,63.04 62.32,62.97 62.32,62.5 T2.1
  Bottom 0.305: 57.79,46.67 v57.79,50.17
  Bottom 0.508: v56.01,44.77 57.79,46.55 57.79,46.67
IR_LS
  Top 0.305: U$17.PB15 68.17,41.49
  Top 0.508: 68.17,41.49 R19.2
  Top 1.524: R19.2 71.86,41.59 T5.1
IR_R  (via drill 0.61)
  Top 0.305: U$17.PB10 62.87,32.38 62.87,32.7 v62.23,32.7
  Top 0.508: 58.32,10.69 R10.2 58.74,10.71 v58.74,11.43 | v66.9,16.19 66.9,23.1 v66.77,23.23
  Top 1.524: R10.2 58.32,9.04 T4.1
  Bottom 0.508: v62.23,32.7 62.23,30.11 66.9,25.44 66.9,23.69 66.77,23.55 v66.77,23.23 | v66.9,16.19 66.04,16.19 66.04,16.14 65.18,15.28 65.18,15.01 61.28,11.11 59.05,11.11 v58.74,11.43
IR_RF  (via drill 0.61)
  Top 0.305: 62.55,13.87 R8.2 | U$17.PB11 65.03,30.94 65.03,30.73 v68.9,26.86
  Top 0.508: R8.2 62.55,14.07 62.55,17.78 v63.5,18.73 v63.5,18.74
  Top 1.016: T3.1 62.55,13.87
  Bottom 0.508: v68.9,26.86 68.92,24.13 68.61,23.82 68.58,23.82 v63.5,18.74
IR_RS
  Top 0.305: 64.77,37.15 64.47,37.15 64.47,37.09 U$17.PB14
  Top 0.508: T6.1 74.68,34.66 73.51,33.49 72.54,33.49 68.88,37.15 64.77,37.15
  Top 1.524: R23.2 74.83,34.76 T6.1
L_CA  (via drill 0.61)
  Top 0.305: U$17.PA15 55.32,41.35 55.25,41.43 v55.25,50.17
  Bottom 0.305: 10.86,59.12 U$5.L_CHA | 55.25,51.75 v55.25,50.17
  Bottom 0.508: 55.25,51.75 46.99,60.01 11.75,60.01 10.86,59.12
L_CB  (via drill 0.35, 0.61)
  Top 0.305: U$17.PB3 51.54,41.59 v51.44,41.59
  Top 0.508: U$5.L_CHB 9.8,56.99 v36.04,56.99
  Bottom 0.508: v36.04,56.99 v51.44,41.59
L_PWM_A  (via drill 0.61)
  Top 0.305: U$17.PB6 49.74,41.28 49.53,41.28
  Top 0.508: v38.1,44.45 U1.12 | v45.72,44.45 46.36,44.45 49.53,41.28
  Bottom 0.508: v38.1,44.45 v45.72,44.45
L_PWM_B  (via drill 0.61)
  Top 0.305: 52.78,37.47 U$17.PB7 49.59,40.72 49.3,40.72 48.61,41.4 47.31,41.4
  Top 0.508: v43.51,45.53 47.31,41.4 | v29.85,45.09 29.21,44.45 U1.19
  Bottom 0.508: v43.51,45.53 30.29,45.53 v29.85,45.09
LED_L
  Top 1.524: 50.93,67.32 U$6.- 50.8,65.63 R3.2
LED_LF
  Top 1.524: R5.2 66.01,64.6 U$7.-
LED_LS
  Top 1.016: U$25.- 75.25,46.95 R18.2
LED_R
  Top 1.524: R9.2 52.44,6.16 50.8,7.8 U$9.-
LED_RF
  Top 1.27: R7.2 64.22,12.75 64.83,12.14 65.06,12.14 65.52,11.67 65.52,11.45 U$8.-
LED_RS
  Top 1.524: R21.2 75.91,29.23 U$28.-
M1B
  Top 1.524: U$5.L_MOTOR_B 19.48,39.47 19.48,39.31 20.6,38.16 26.9,38.16 | 26.9,38.16 26.99,38.1 | U1.18 30.48,41.49 29.87,40.88 29.77,40.88 27.05,38.16 26.9,38.16
M1F  (via drill 0.61)
  Top 1.524: v35.24,40.64 35.48,40.88 36.22,40.88 36.83,41.49 U1.13
  Bottom 1.524: U$5.L_MOTOR_A 21.93,40.64 v35.24,40.64
M2B
  Top 1.524: U$5.R_MOTOR_B 21.52,36.23 27.56,36.23 27.59,36.2 29.21,36.2 30.48,34.93 U1.3
M2F  (via drill 0.61)
  Top 1.524: v34.29,38.1 36.83,35.56 U1.8
  Bottom 1.524: U$5.R_MOTOR_A 19.48,36.73 19.48,36.89 20.69,38.1 v34.29,38.1
MGND  (via drill 0.61)
  Top 1.905: U$22.1 v16.51,15.53
  Bottom 1.905: v16.51,15.53 33.02,31.75 v33.02,35.56
  pour Top (rank 3, no thermals): 28.57,51.44 28.57,30.48 49.53,30.48 49.53,51.44
N$1
  Top 1.778: 2.81,22.5 U$2.+
  Top 1.905: S1.2 4.13,28.57 5.4,27.3 5.4,25.08 2.81,22.5
N$2
  Top 1.778: U$2.- 4.81,19.1 | 2.81,17.1 U$3.+
  Top 1.905: 4.81,19.1 2.81,17.1
N$4
  Top 1.016: R5.1 64.14,61.28 63.03,60.18 T2.3
N$6
  Top 1.016: NPN.3 41.28,52.88 D1.A 43.55,56.91 SG1.-
N$7
  Top 1.524: T1.3 51.61,63.86 52.58,64.84 52.58,65.51 R3.1
N$8
  Top 1.016: T3.3 61.59,10.46 61.92,10.79 64.03,10.79 R7.1
N$10
  Top 1.524: T4.3 57.47,6.35 57.15,6.35 56.83,6.03 56.1,6.03 R9.1
N$11
  Top 1.016: C18.2 C17.2 51.85,18.63 U$23.3.VCONT
N$12
  Top 1.016: U$4.4 5.08,50.65 C3.2
N$13
  Top 0.305: C20.2 60.33,41.43 U$17.VCAP_2
N$14
  Top 0.305: C24.2 65.84,30.83 U$17.VCAP_1
N$16
  Top 0.305: R15.2 64.8,29.75 U$17.PB2
N$18
  Top 1.016: C18.1 55.46,16.84 R22.2
N$20
  Top 1.016: PWR_R.2 PWR_LED.C
N$21
  Top 1.016: T5.3 75.25,40.79 R18.1
N$23
  Top 1.016: T6.3 74.21,32.33 R21.1
NRST  (via drill 0.61)
  Top 0.305: v53.98,32.07 53.98,31.54 U$17.NRST 53.19,30.69 52.71,30.21 52.71,30.16 51.75,29.21 50.8,29.21 50.48,28.89
  Top 0.508: 50.48,28.89 44.77,23.18 v37.47,23.18
  Top 1.016: v37.47,19.68 38.52,18.63 R_RST_UP.1 | C_RST.2 37.47,24.04 v37.47,23.18
  Bottom 0.305: v53.98,32.07 53.98,32.58 58.55,37.15 58.55,37.29
  Bottom 0.508: JP2.4 51.44,45.21 58.55,38.1 58.55,37.29
  Bottom 1.016: v37.47,23.18 37.47,20.32 | 37.47,20.32 v37.47,19.68 | 37.47,20.32 35.56,18.41 S4.2
OUTZ  (via drill 0.61)
  Top 0.305: U$17.PC5 66.01,26.42 66.01,25.11
  Top 0.508: v50.17,18.77 49.96,18.97 49.71,18.97 49.13,19.55 U$23.6.OUTZ | 66.01,25.11 v66.04,25.08
  Bottom 0.508: v66.04,25.08 65.61,24.65 65.61,23.55 63.01,20.95 51.75,20.95 50.8,20 50.8,19.37 50.2,18.77 v50.17,18.77
R_CA  (via drill 0.61)
  Top 0.305: U$17.PA0_WKUP 54.52,27.13 v54.52,26.76
  Bottom 0.508: 29.21,17.91 U$5.R_CHA 29.39,20.54 31.23,22.38 31.23,24.56 33.75,27.08 54.2,27.08 v54.52,26.76
R_CB  (via drill 0.61)
  Top 0.305: U$17.PA1 55.28,27.19 55.28,25.81
  Top 0.508: v54.48,25.4 54.87,25.4 55.28,25.81
  Bottom 0.508: v54.48,25.4 53.53,26.35 34.11,26.35 31.89,24.13 31.89,17.77 U$5.R_CHB
R_PWM_A  (via drill 0.61)
  Top 0.305: U1.9 38.1,40.01 v38.42,40.32 | v50.89,37.58 51.32,37.58 U$17.PB8
  Bottom 0.305: 50.29,38.17 v50.89,37.58
  Bottom 0.508: 50.29,38.17 49.02,39.37 48.07,40.32 v38.42,40.32
R_PWM_B  (via drill 0.61)
  Top 0.305: U$17.PB9 52.71,35.48 v52.71,34.93
  Top 0.508: U1.2 29.21,31.43 30.16,30.48 v51.44,30.48
  Bottom 0.305: v52.71,34.93 52.71,31.75 v51.44,30.48
REC_L  (via drill 0.61)
  Top 0.305: U$17.PC0 55.25,32.1 v55.25,32.64
  Top 1.27: v41.91,65.41 R11.2
  Bottom 0.508: v55.25,32.64 55.25,33.02 59.42,37.24 59.42,45.77 60.4,46.74 60.4,49.37 42.14,67.63 41.91,67.63
  Bottom 1.27: U$19.E 41.91,69.98 41.91,67.63 v41.91,65.41
REC_LF  (via drill 0.61)
  Top 0.305: U$17.PC1 56.83,32.98 v56.83,33.02
  Top 0.508: v64.45,40.64 70.52,46.71 R12.2
  Top 1.016: R12.2 69.35,57.08 U$18.E
  Bottom 0.508: v64.45,40.64 v56.83,33.02
REC_LS  (via drill 0.61)
  Top 0.305: 73.98,53 U$27.E | U$17.PB1 62.67,31.11 62.19,31.59 61.94,31.59 61.53,31.18 v60.96,31.75
  Top 0.508: 73.98,53 73.98,45.72 71.12,42.86 67.95,42.86 v63.82,38.74
  Top 1.016: R20.2 72.42,54.83 72.62,54.63 73.15,54.63 U$27.E
  Bottom 0.508: v60.96,31.75 60.96,35.88 v63.82,38.74
REC_R  (via drill 0.61)
  Top 0.305: U$17.PA4 63.88,25.02 63.88,24.64 66.04,22.48
  Top 0.508: 66.04,22.48 v66.04,14.92
  Top 1.016: U$11.E 41.91,6.21 R14.2
  Bottom 0.508: U$11.E 43.39,5.58 44.76,6.95 58.07,6.95 v66.04,14.92
REC_RF
  Top 0.305: U$17.PA5 65.5,24.1
  Top 0.508: 65.5,24.1 67.34,24.1 R13.2
  Top 1.016: R13.2 71.15,19.89 70.93,19.67 70.93,17.46 U$15.E
REC_RS
  Top 0.305: U$17.PB0 66.71,26.43 67.2,25.93
  Top 0.508: 67.2,25.93 71.58,21.56 R24.2
  Top 1.016: U$30.E 73.56,22.89 R24.2
RX
  Top 0.305: 64.45,43.04 64.45,42.73 U$17.PA10
  Top 0.508: JP3.2 64.45,43.04
S_MODE  (via drill 0.61)
  Top 0.305: U$17.PC3 53.84,28.57 53.34,28.57
  Top 0.508: v26.67,28.26 32.7,22.22 44.77,22.22 51.12,28.57 53.34,28.57 | v8.25,44.45 8.25,56.52 6.03,58.74 4.85,58.74 S2.2
  Bottom 0.508: v26.67,28.26 20.23,34.69 17.64,34.69 8.25,44.08 v8.25,44.45
SWCLK  (via drill 0.61)
  Top 0.305: U$17.PA14 56.01,41.37 v56.01,43.5
  Bottom 0.508: v56.01,43.5 59.05,46.55 JP2.1
SWDIO  (via drill 0.61)
  Top 0.305: U$17.PA13 59.29,39.69 v58.42,39.69
  Bottom 0.508: JP2.3 53.98,44.13 v58.42,39.69
TX
  Top 0.305: U$17.PA9 65.09,42.65
  Top 0.508: 65.09,42.65 65.09,42.74 65.11,42.77 65.11,51.78 JP3.1
V_BUZZ  (via drill 0.61)
  Top 0.305: U$17.PA11 58.8,37.78 v57.15,37.78
  Top 0.508: v45.09,46.67 R27.2
  Top 0.762: NPN.1 43.55,49.48 44.67,48.36 R27.2
  Bottom 0.508: v45.09,46.67 46.23,45.4 53.34,37.97 53.53,37.78 v57.15,37.78
V_REG  (via drill 0.61)
  Top 0.305: U$17.PA2 55.88,27.08 55.88,24.45 v53.66,22.54
  Top 1.016: R2.2 9.16,33.34 R1.1
  Top 1.27: v17.78,21.27 28.05,21.27 28.23,21.09 45.22,21.09 v46.67,22.54 | v14.29,30.48 12.01,30.48 9.16,33.34
  Bottom 0.508: v53.66,22.54 v46.67,22.54
  Bottom 1.27: v17.78,21.27 17.78,26.99 v14.29,30.48
VBAT
  pour Top (no thermals): 0.64,25.08 18.41,25.08 28.57,37.78 28.57,44.13 13.97,44.13 7.62,38.74 0.64,38.74
VREF  (via drill 0.61)
  Top 0.305: U$17.PC4 61.71,30.05 62.55,29.21 62.55,28.89 62.55,28.57
  Top 0.508: v47.94,19.37 47.94,19.2 U$23.7.VREF | 62.55,28.89 62.55,28.13 v64.94,25.73
  Bottom 0.508: v47.94,19.37 49.92,21.67 62.79,21.67 64.94,23.82 v64.94,25.73